# EAGLE design motorCtlv1 (EAGLE 5.11)
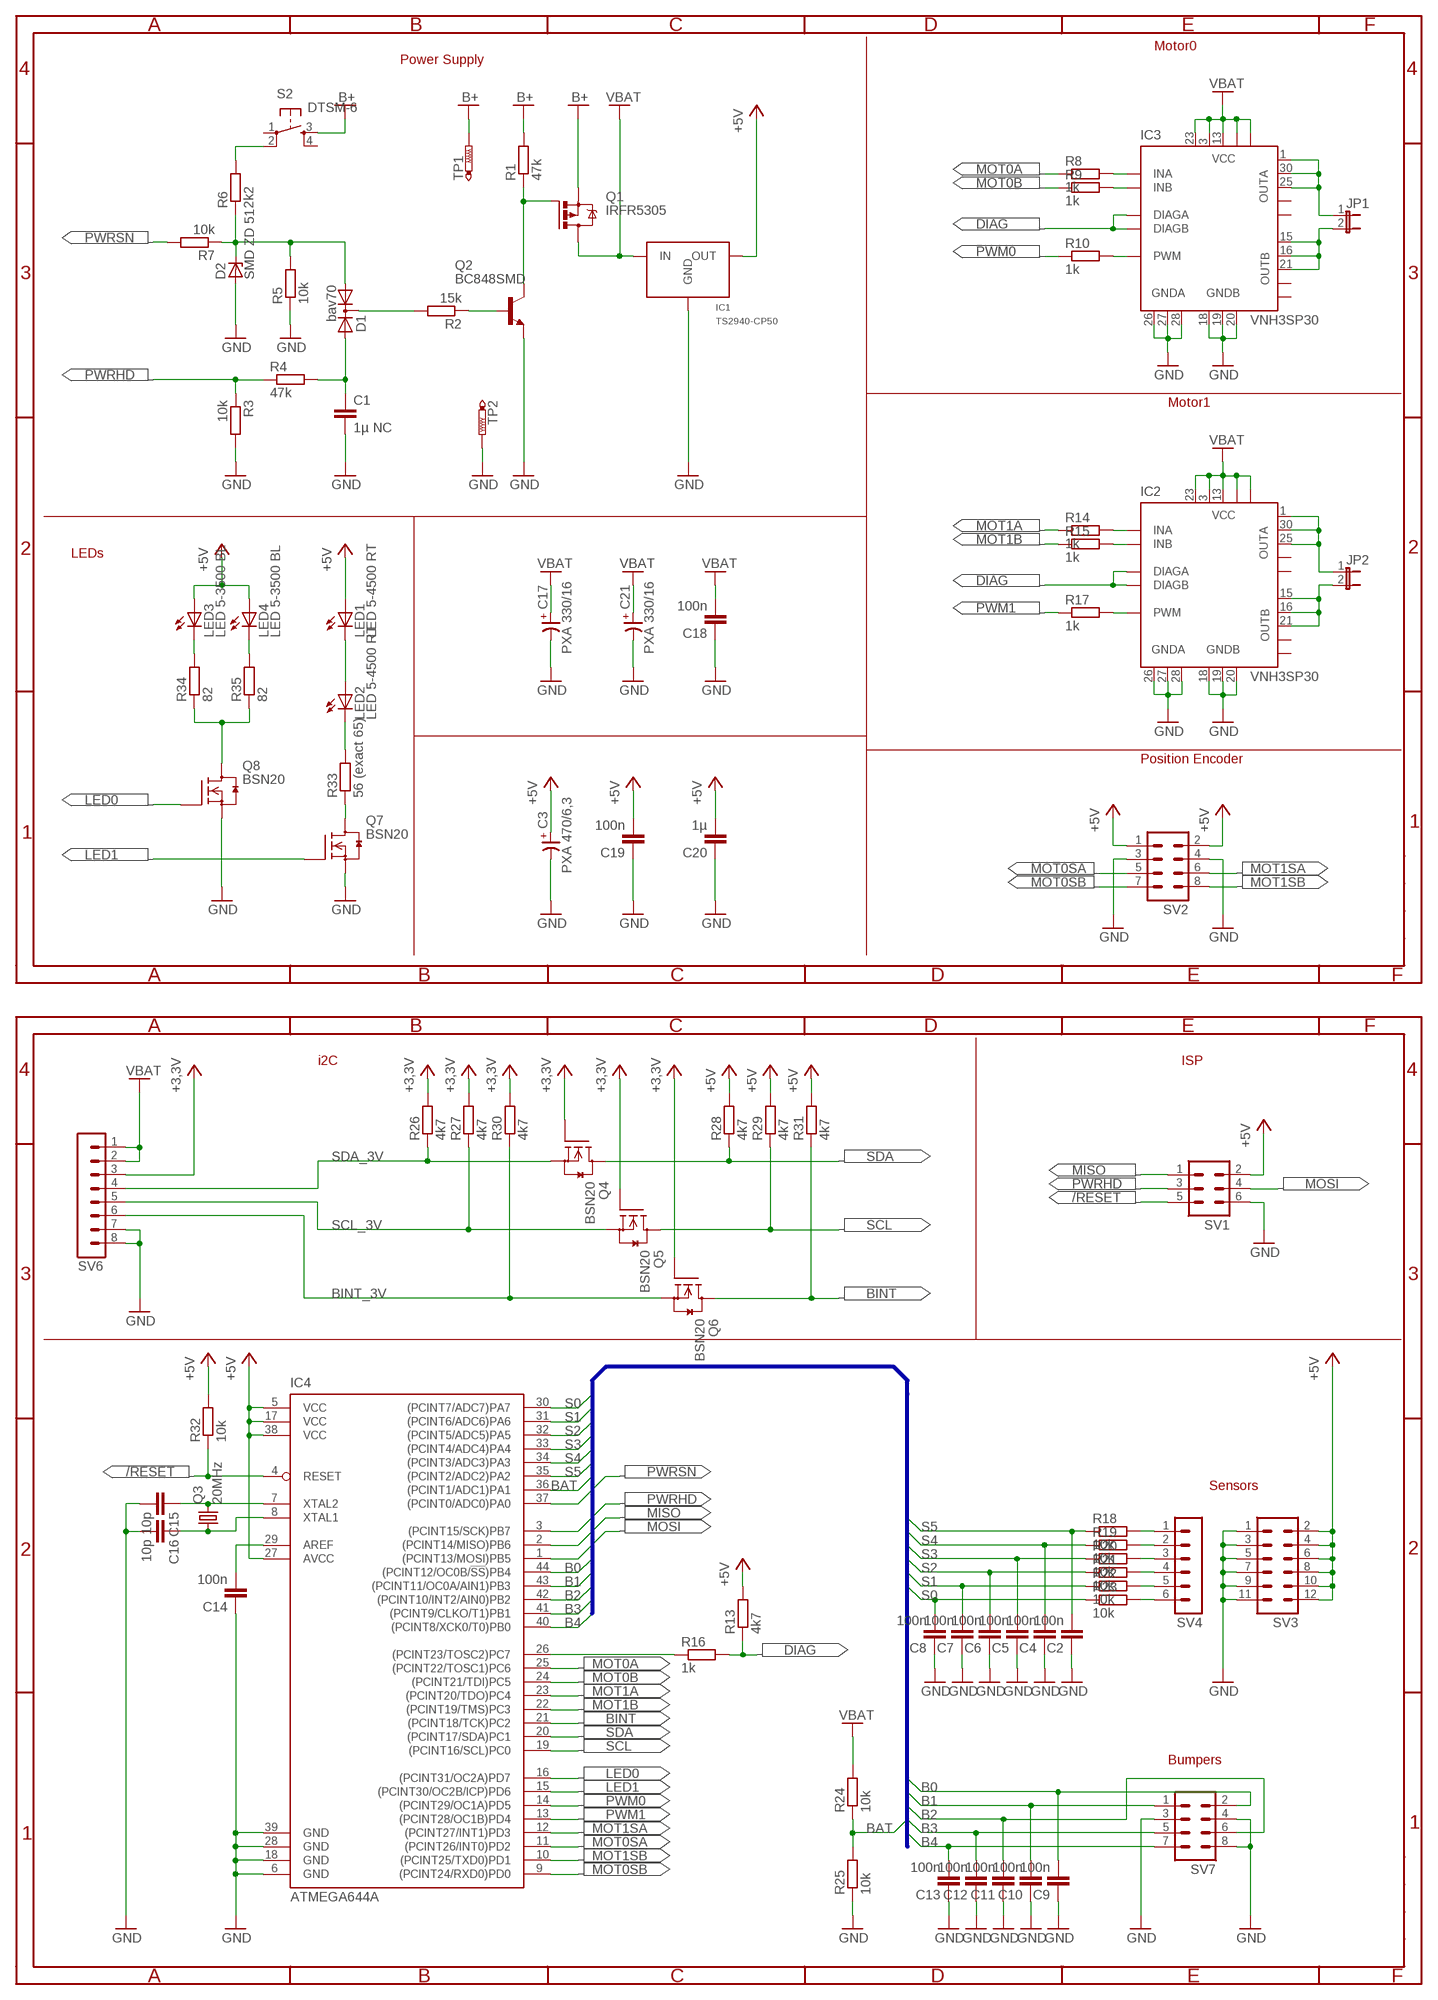
[diagram p0: schematic, sheet 1]

## Parts
C1  1µ NC  C-EUC0603  [C0603]
C2  100n  C-EUC0603  [C0603]
C3  PXA 470/6,3  CP-SV-G  [SV-G]
C4  100n  C-EUC0603  [C0603]
C5  100n  C-EUC0603  [C0603]
C6  100n  C-EUC0603  [C0603]
C7  100n  C-EUC0603  [C0603]
C8  100n  C-EUC0603  [C0603]
C9  100n  C-EUC0603  [C0603]
C10  100n  C-EUC0603  [C0603]
C11  100n  C-EUC0603  [C0603]
C12  100n  C-EUC0603  [C0603]
C13  100n  C-EUC0603  [C0603]
C14  100n  C-EUC0603  [C0603]
C15  10p  C-EUC0603  [C0603]
C16  10p  C-EUC0603  [C0603]
C17  PXA 330/16  CP-SV-G  [SV-G]
C18  100n  C-EUC0603  [C0603]
C19  100n  C-EUC0603  [C0603]
C20  1µ  C-EUC0603  [C0603]
C21  PXA 330/16  CP-SV-G  [SV-G]
D1  bav70  DIODE-2AC|CASOT23  [SOT23]
D2  SMD ZD 51  ZENER-DIODESOT23  [SOT23]
IC1  TS2940-CP50  TS2940  [TO252]
IC2  VNH3SP30  [MULTIPOWERSO-30]
IC3  VNH3SP30  [MULTIPOWERSO-30]
IC4  ATMEGA644A  [TQFP44]
JP1  JP1E  [JP1]
JP2  JP1E  [JP1]
LED1  LED 5-4500 RT  LED5MM  [LED5MM]
LED2  LED 5-4500 RT  LED5MM  [LED5MM]
LED3  LED 5-3500 BL  LED5MM  [LED5MM]
LED4  LED 5-3500 BL  LED5MM  [LED5MM]
Q1  IRFR5305  [D-PAK_TO252AA]
Q2  BC848SMD  [SOT23]
Q3  20MHz  CRYSTALHC49UP  [HC49UP]
Q4  BSN20  BSS138  [SOT23]
Q5  BSN20  BSS138  [SOT23]
Q6  BSN20  BSS138  [SOT23]
Q7  BSN20  BSS138  [SOT23]
Q8  BSN20  BSS138  [SOT23]
R1  47k  R-EU_R0603  [R0603]
R2  15k  R-EU_R0603  [R0603]
R3  10k  R-EU_R0603  [R0603]
R4  47k  R-EU_R0603  [R0603]
R5  10k  R-EU_R0603  [R0603]
R6  2k2  R-EU_R0603  [R0603]
R7  10k  R-EU_R0603  [R0603]
R8  1k  R-EU_R0603  [R0603]
R9  1k  R-EU_R0603  [R0603]
R10  1k  R-EU_R0603  [R0603]
R13  4k7  R-EU_R0603  [R0603]
R14  1k  R-EU_R0603  [R0603]
R15  1k  R-EU_R0603  [R0603]
R16  1k  R-EU_R0603  [R0603]
R17  1k  R-EU_R0603  [R0603]
R18  10k  R-EU_R0603  [R0603]
R19  10k  R-EU_R0603  [R0603]
R20  10k  R-EU_R0603  [R0603]
R21  10k  R-EU_R0603  [R0603]
R22  10k  R-EU_R0603  [R0603]
R23  10k  R-EU_R0603  [R0603]
R24  10k  R-EU_R0603  [R0603]
R25  10k  R-EU_R0603  [R0603]
R26  4k7  R-EU_R0603  [R0603]
R27  4k7  R-EU_R0603  [R0603]
R28  4k7  R-EU_R0603  [R0603]
R29  4k7  R-EU_R0603  [R0603]
R30  4k7  R-EU_R0603  [R0603]
R31  4k7  R-EU_R0603  [R0603]
R32  10k  R-EU_R0603  [R0603]
R33  56 (exact 65)  R-EU_R0603  [R0603]
R34  82  R-EU_R0603  [R0603]
R35  82  R-EU_R0603  [R0603]
S2  DTSM-6  [DTSM-6]
SV1  ML6  [ML6]
SV2  MA04-2  [MA04-2]
SV3  MA06-2  [MA06-2]
SV4  MA06-1  [MA06-1]
SV6  MA08-1  [MA08-1]
SV7  MA04-2  [MA04-2]
TP1  PTR1PAD1-13Y  [P1-13Y]
TP2  PTR1PAD1-13Y  [P1-13Y]

## Nets
0A: IC3.1(OUTA) IC3.25(OUTA) IC3.30(OUTA) JP1.1
0B: IC3.15(OUTB) IC3.16(OUTB) IC3.21(OUTB) JP1.2
1A: IC2.1(OUTA) IC2.25(OUTA) IC2.30(OUTA) JP2.1
1B: IC2.15(OUTB) IC2.16(OUTB) IC2.21(OUTB) JP2.2
$N35: C1.1 D1.2(A2) R4.2
+3,3V: Q4.1(G) Q5.1(G) Q6.1(G) R26.2 R27.2 R30.2 SV6.3
+5V: C3.+ C19.2 C20.2 IC1.R(OUT) IC4.5(VCC) IC4.17(VCC) IC4.27(AVCC) IC4.38(VCC) LED1.A LED3.A LED4.A R13.2 R28.2 R29.2 R31.2 R32.2 SV1.2 SV2.1 SV2.2 SV3.2 SV3.4 SV3.6 SV3.8 SV3.10 SV3.12
/RESET: IC4.4(RESET) R32.1 SV1.5
B0: C9.2 IC4.44((PCINT12/OC0B/!SS!)PB4) SV7.2
B1: C10.2 IC4.43((PCINT11/OC0A/AIN1)PB3) SV7.1
B2: C11.2 IC4.42((PCINT10/INT2/AIN0)PB2) SV7.6
B3: C12.2 IC4.41((PCINT9/CLKO/T1)PB1) SV7.5
B4: C13.2 IC4.40((PCINT8/XCK0/T0)PB0) SV7.7
B+: Q1.3(S) R1.2 S2.3 TP1.TP
BAT: IC4.36((PCINT1/ADC1)PA1) R24.1 R25.2
BINT: IC4.21((PCINT18/TCK)PC2) Q6.3(D) R31.1
BINT_3V: Q6.2(S) R30.1 SV6.6
DIAG: IC2.6(DIAGA) IC2.10(DIAGB) IC3.6(DIAGA) IC3.10(DIAGB) R13.1 R16.2
GND: C1.2 C2.1 C3.- C4.1 C5.1 C6.1 C7.1 C8.1 C9.1 C10.1 C11.1 C12.1 C13.1 C14.1 C15.2 C16.2 C17.- C18.1 C19.1 C20.1 C21.- D2.1(A) IC1.H(GND) IC2.18(GNDB) IC2.19(GNDB) IC2.20(GNDB) IC2.26(GNDA) IC2.27(GNDA) IC2.28(GNDA) IC3.18(GNDB) IC3.19(GNDB) IC3.20(GNDB) IC3.26(GNDA) IC3.27(GNDA) IC3.28(GNDA) IC4.6(GND) IC4.18(GND) IC4.28(GND) IC4.39(GND) Q2.2(E) Q7.2(S) Q8.2(S) R3.2 R5.1 R25.1 SV1.6 SV2.3 SV2.4 SV3.1 SV3.3 SV3.5 SV3.7 SV3.9 SV3.11 SV6.7 SV6.8 SV7.3 SV7.4 SV7.8 TP2.TP
LED0: IC4.16((PCINT31/OC2A)PD7) Q8.1(G)
LED1: IC4.15((PCINT30/OC2B/ICP)PD6) Q7.1(G)
MISO: IC4.2((PCINT14/MISO)PB6) SV1.1
MOSI: IC4.1((PCINT13/MOSI)PB5) SV1.4
MOT0A: IC4.25((PCINT22/TOSC1)PC6) R8.1
MOT0B: IC4.24((PCINT21/TDI)PC5) R9.1
MOT0SA: IC4.11((PCINT26/INT0)PD2) SV2.5
MOT0SB: IC4.9((PCINT24/RXD0)PD0) SV2.7
MOT1A: IC4.23((PCINT20/TDO)PC4) R14.1
MOT1B: IC4.22((PCINT19/TMS)PC3) R15.1
MOT1SA: IC4.12((PCINT27/INT1)PD3) SV2.6
MOT1SB: IC4.10((PCINT25/TXD0)PD1) SV2.8
N$1: LED3.K(C) R34.2
N$2: IC2.8(PWM) R17.2
N$3: IC4.26((PCINT23/TOSC2)PC7) R16.1
N$4: LED4.K(C) R35.2
N$5: IC3.5(INA) R8.2
N$6: IC3.11(INB) R9.2
N$7: LED2.K(C) R33.2
N$8: IC3.8(PWM) R10.2
N$9: Q7.3(D) R33.1
N$10: D1.1(A1) D2.3(C) R5.2 R6.1 R7.1
N$11: LED1.K(C) LED2.A
N$12: R18.2 SV4.1
N$13: IC2.5(INA) R14.2
N$14: IC2.11(INB) R15.2
N$15: R19.2 SV4.2
N$16: R20.2 SV4.3
N$17: R21.2 SV4.4
N$18: R22.2 SV4.5
N$19: R23.2 SV4.6
N$20: C15.1 IC4.7(XTAL2) Q3.2
N$21: C16.1 IC4.8(XTAL1) Q3.1
N$23: C14.2 IC4.29(AREF)
N$26: Q8.3(D) R34.1 R35.1
N$32: Q2.1(B) R2.1
N$33: D1.3(C) R2.2
N$34: Q1.1(G) Q2.3(C) R1.1
N$35: R6.2 S2.2
PWM0: IC4.14((PCINT29/OC1A)PD5) R10.1
PWM1: IC4.13((PCINT28/OC1B)PD4) R17.1
PWRHD: IC4.3((PCINT15/SCK)PB7) R3.1 R4.1 SV1.3
PWRSN: IC4.37((PCINT0/ADC0)PA0) R7.2
S0: C8.2 IC4.30((PCINT7/ADC7)PA7) R23.1
S1: C7.2 IC4.31((PCINT6/ADC6)PA6) R22.1
S2: C6.2 IC4.32((PCINT5/ADC5)PA5) R21.1
S3: C5.2 IC4.33((PCINT4/ADC4)PA4) R20.1
S4: C4.2 IC4.34((PCINT3/ADC3)PA3) R19.1
S5: C2.2 IC4.35((PCINT2/ADC2)PA2) R18.1
SCL: IC4.19((PCINT16/SCL)PC0) Q5.3(D) R29.1
SCL_3V: Q5.2(S) R27.1 SV6.5
SDA: IC4.20((PCINT17/SDA)PC1) Q4.3(D) R28.1
SDA_3V: Q4.2(S) R26.1 SV6.4
VBAT: C17.+ C18.2 C21.+ IC1.L(IN) IC2.3(VCC) IC2.13(VCC) IC2.23(VCC) IC2.VCC IC2.VCC@1(VCC) IC3.3(VCC) IC3.13(VCC) IC3.23(VCC) IC3.VCC IC3.VCC@1(VCC) Q1.4(D) R24.2 SV6.1 SV6.2
Unconnected: IC2.OUTA IC2.OUTA@1(OUTA) IC2.OUTB IC2.OUTB@1(OUTB) IC3.OUTA IC3.OUTA@1(OUTA) IC3.OUTB IC3.OUTB@1(OUTB) S2.1 S2.4

## Buses
S[0..5],B[0..5],BAT

## Notes on the sheet
- Motor0
- Power Supply
- Motor1
- LEDs
- Position Encoder
- i2C | ISP
- Sensors
- Bumpers

## Library data of the parts
C1 C2 C4-C16 C18-C20 = rcl-2:C-EU: CAPACITOR, European symbol
C3 C17 C21 = cap-master:CP-: POLARIZED CAP
D1 = diode:DIODE-2AC|CA: Dual DIODE Anode-Cathode|Cathode-Anode
D2 = diode:ZENER-DIODE: Z-Diode
IC1 = sid:TS2940
IC2 IC3 = st-microelectronics-2:VNH3SP30: FULLY INTEGRATED H-BRIDGE MOTOR DRIVER Source: http://pdf1.alldatasheet.com/datasheet-pdf/view/84563/STMICROELECTRONICS/VNH3SP30.html
IC4 = atmel:ATMEGA644: 8-bit Microcontroller with 64K Bytes In-System Programmable Flash Source: http://www.atmel.com/dyn/resources/prod_documents/doc2593.pdf; MPN: ATMEGA644PV-10AU; OC_FARNELL: 1455123; OC_NEWARK: 58M3748
JP1 JP2 = jumper:JP1E: JUMPER
LED1-LED4 = led:LED: LED OSRAM: - CHIPLED LG R971, LG N971, LY N971, LG Q971, LY Q971, LO R971, LY R971 LH N974, LH R974 LS Q976, LO Q976, LY Q976 LO Q996 - Hyper CHIPLED LW Q18S LB Q993, LB Q99A, LB R99A - SideLED LS A670, LO A670, LY A670, LG A670, LP A670 LB A673, LV A673, LT A673, LW A673 LH A674 LY A675 LS A676, LA A676, LO A676, LY A676, LW A676 LS A679, LY A679, LG A679 - Hyper Micro SIDELED® LS Y876, LA Y876, LO Y876, LY Y876 LT Y87S - SmartLED LW L88C, LW L88S LB L89C, LB L89S, LG L890 LS L89K, LO L89K, LY L89K LS L896, LA L896, LO L896, LY L896 - TOPLED LS T670, LO T670, LY T670, LG T670, LP T670 LSG T670, LSP T670, LSY T670, LOP T670, LYG T670 LG T671, LOG T671, LSG T671 LB T673, LV T673, LT T673, LW T673 LH T674 LS T676, LA T676, LO T676, LY T676, LB T676, LH T676, LSB T676, LW T676 LB T67C, LV T67C, LT T67C, LS T67K, LO T67K, LY T67K, LW E67C LS E67B, LA E67B, LO E67B, LY E67B, LB E67C, LV E67C, LT E67C LW T67C LS T679, LY T679, LG T679 LS T770, LO T770, LY T770, LG T770, LP T770 LB T773, LV T773, LT T773, LW T773 LH T774 LS E675, LA E675, LY E675, LS T675 LS T776, LA T776, LO T776, LY T776, LB T776 LHGB T686 LT T68C, LB T68C - Hyper Mini TOPLED® LB M676 - Mini TOPLED Santana® LG M470 LS M47K, LO M47K, LY M47K Source: http://www.osram.convergy.de LUXEON: - LUMILED® LXK2-PW12-R00, LXK2-PW12-S00, LXK2-PW14-U00, LXK2-PW14-V00 LXK2-PM12-R00, LXK2-PM12-S00, LXK2-PM14-U00 LXK2-PE12-Q00, LXK2-PE12-R00, LXK2-PE12-S00, LXK2-PE14-T00, LXK2-PE14-U00 LXK2-PB12-K00, LXK2-PB12-L00, LXK2-PB12-M00, LXK2-PB14-N00, LXK2-PB14-P00, LXK2-PB14-Q00 LXK2-PR12-L00, LXK2-PR12-M00, LXK2-PR14-Q00, LXK2-PR14-R00 LXK2-PD12-Q00, LXK2-PD12-R00, LXK2-PD12-S00 LXK2-PH12-R00, LXK2-PH12-S00 LXK2-PL12-P00, LXK2-PL12-Q00, LXK2-PL12-R00 Source: www.luxeon.com KINGBRIGHT: KA-3528ASYC Source: www.kingbright.com
Q1 = transistor-power:IRF?5305: HEXFET Power MOSFET Source: http://www.irf.com/product-info/datasheets/data/irfr5305pbf.pdf
Q2 = transistor-npn:BC848*: NPN Transistor
Q3 = crystal:CRYSTAL: CRYSTAL; OC_FARNELL: unknown; OC_NEWARK: unknown
Q4-Q8 = m-pad-2.1:BSS138: Fairchild Semiconductors BSS138 N-Channel Logic Level Enhancement Mode Field Effect Transistor General Description: These N-Channel enhancement mode field effect transistors are produced using Fairchild's proprietary, high cell density, DMOS technology. These products have been designed to minimize on-state resistance while provide rugged, reliable, and fast switching performance.These products are particularly suited for low voltage, low current applications such as small servo motor control, power MOSFET gate drivers, and other switching applications. Features: 0.22 A, 50 V. RDS(ON) = 3.5Ohm @ VGS = 10 V RDS(ON) = 6.0Ohm @ VGS = 4.5 V High density cell design for extremely low RDS(ON) Rugged and Reliable Compact industry standard SOT-23 surface mount package Please send any comments to: messi@users.sourceforge.net
R1-R10 R13-R35 = rcl-2:R-EU_: RESISTOR, European symbol
S2 = switch-tact:DTSM-6
SV1 = con-harting-ml:ML6: HARTING; OC_FARNELL: unknown; OC_NEWARK: unknown
SV2 SV7 = con-lstb:MA04-2: PIN HEADER; OC_FARNELL: unknown; OC_NEWARK: unknown
SV3 = con-lstb:MA06-2: PIN HEADER; OC_FARNELL: unknown; OC_NEWARK: unknown
SV4 = con-lstb:MA06-1: PIN HEADER; OC_FARNELL: unknown; OC_NEWARK: unknown
SV6 = con-lstb:MA08-1: PIN HEADER; OC_FARNELL: unknown; OC_NEWARK: unknown
TP1 TP2 = testpad:PTR1: TEST PIN

## Net classes
0 default: width 0.152 mm, drill 0.305 mm, clearance 0.152 mm
1 pwr: width 0.254 mm, drill 0.305 mm, clearance 0.152 mm

## Board
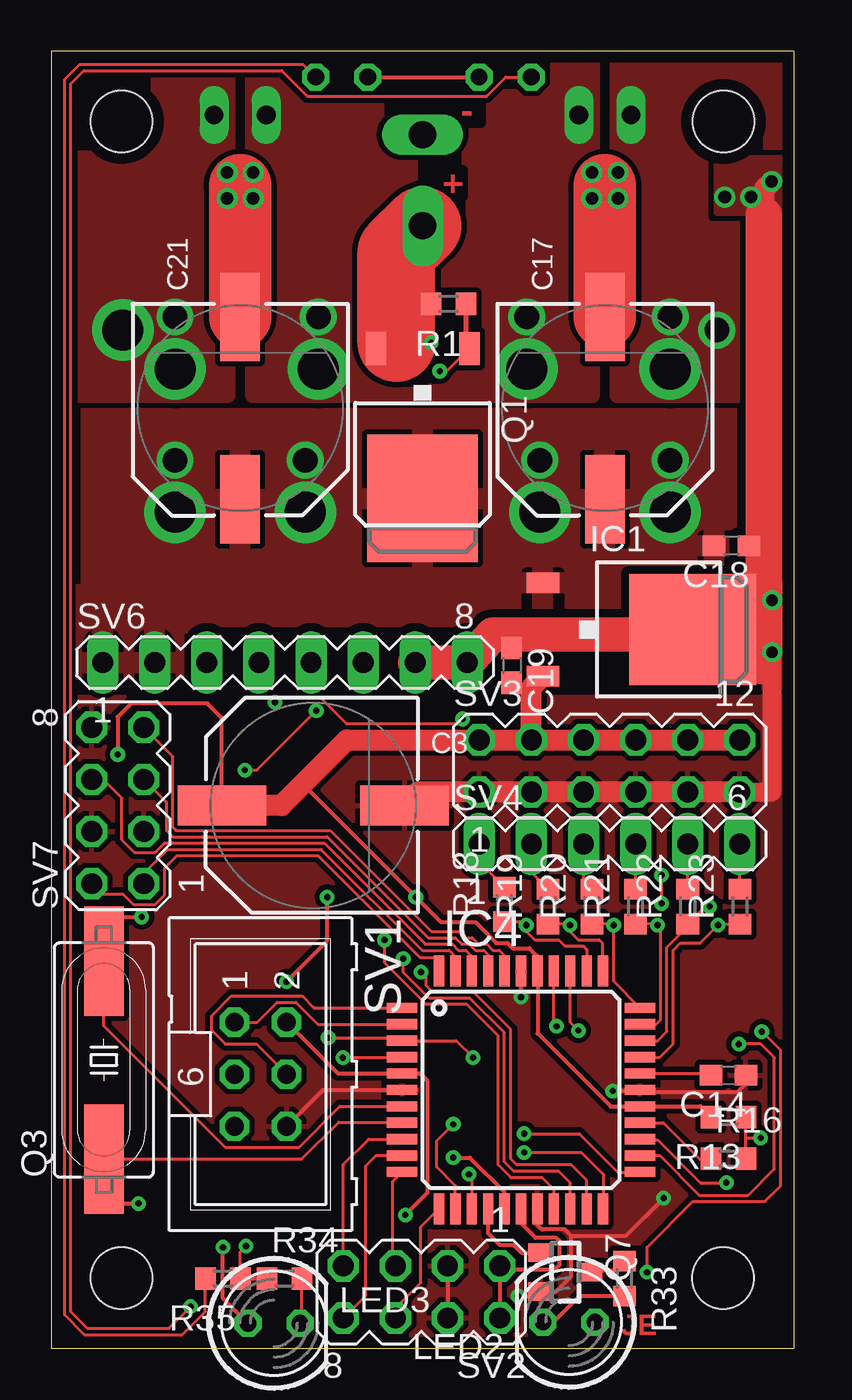
[diagram p1: board, top side]
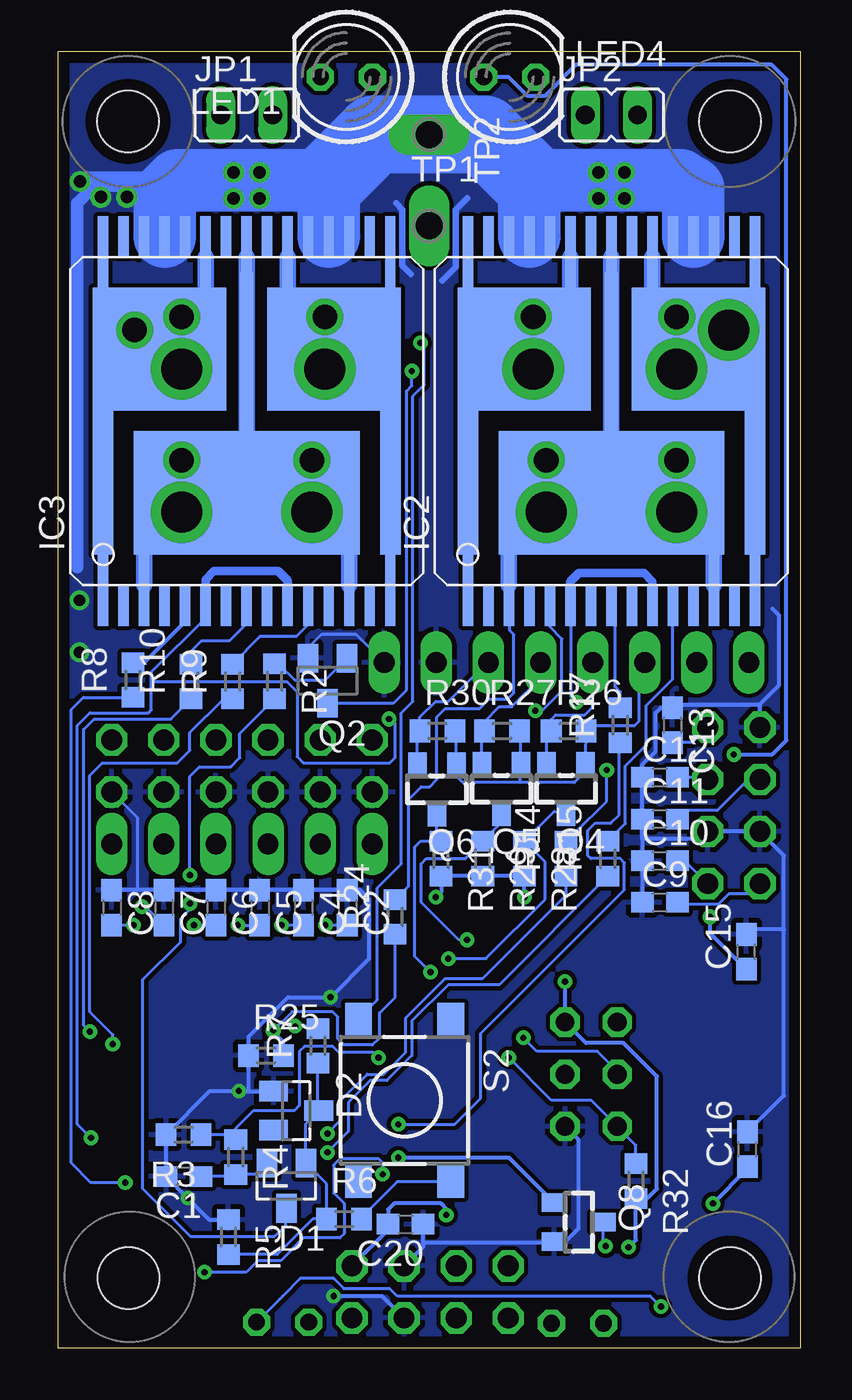
[diagram p2: board, bottom side, seen from below]

Size 36.2 x 63.25 mm. Coordinates in mm from the lower left corner, seen from the top.
Outline: 36.19,63.25 0,63.25 0,0 36.19,0 36.19,63.25
Copper layers (1*16): Top 0.035mm / dielectric 1.5mm / Bottom 0.035mm
Design rules "default *": minimum track width 6mil, minimum drill 12mil, track to track 6mil, track to pad 6mil, pad to pad 6mil, via to via 6mil, smd to smd 6mil, copper to edge 22mil, drill to drill 8mil, minimum pad ring 10mil, minimum via ring 8mil, stop-mask expansion 4mil, vias tented up to drill 24mil, thermal gap 10mil
Holes 3 mm at 32.77,59.82 3.43,59.82 3.43,3.43 32.74,3.43

### Footprints (pad centres in the part's own frame; a part is rotated, then mirrored left to right if it is on the bottom)
C0603 = smd 1.1 x 1: 1 -0.85,0; 2 0.85,0
SV-G = smd 4.318 x 1.93: + -4.445,0; - 4.445,0
SOT23 = smd 1 x 1.4: 1 -0.95,-1.1; 2 0.95,-1.1; 3 0,1.1
TO252 = smd 5.4 x 6.2: H 0,1.23 | smd 1 x 1.6: L -2.28,-6.07; R 2.28,-6.07
MULTIPOWERSO-30 = smd 0.508 x 12: 1 -7,-4; 15 7,-4; 16 7,4; 30 -7,4 | smd 0.508 x 2: 2 -6,-9; 4 -4,-9; 5 -3,-9; 6 -2,-9; 7 -1,-9; 8 0,-9; 9 1,-9; 10 2,-9; 11 3,-9; 12 4,-9; 14 6,-9; 17 6,9; 18 5,9; 19 4,9; 20 3,9; 22 1,9; 24 -1,9; 26 -3,9; 27 -4,9; 28 -5,9; 29 -6,9 | smd 0.508 x 4: 3 -5,-8; 13 5,-8; 21 2,8; 23 0,8; 25 -2,8 | smd 6.5 x 6: OUTA -4.25,3.5; OUTB 4.25,3.5 | smd 1 x 7.5: OUTA@1 -7,-2.755; OUTB@1 7,-2.755 | smd 11 x 6: VCC 0,-3.5 | smd 0.65 x 8.3: VCC@1 0,3.145
TQFP44 = smd 1.5 x 0.5: 1 -5.8,4; 2 -5.8,3.2; 3 -5.8,2.4; 4 -5.8,1.6; 5 -5.8,0.8; 6 -5.8,0; 7 -5.8,-0.8; 8 -5.8,-1.6; 9 -5.8,-2.4; 10 -5.8,-3.2; 11 -5.8,-4; 23 5.8,-4; 24 5.8,-3.2; 25 5.8,-2.4; 26 5.8,-1.6; 27 5.8,-0.8; 28 5.8,0; 29 5.8,0.8; 30 5.8,1.6; 31 5.8,2.4; 32 5.8,3.2; 33 5.8,4 | smd 0.5 x 1.5: 12 -4,-5.8; 13 -3.2,-5.8; 14 -2.4,-5.8; 15 -1.6,-5.8; 16 -0.8,-5.8; 17 0,-5.8; 18 0.8,-5.8; 19 1.6,-5.8; 20 2.4,-5.8; 21 3.2,-5.8; 22 4,-5.8; 34 4,5.8; 35 3.2,5.8; 36 2.4,5.8; 37 1.6,5.8; 38 0.8,5.8; 39 0,5.8; 40 -0.8,5.8; 41 -1.6,5.8; 42 -2.4,5.8; 43 -3.2,5.8; 44 -4,5.8
JP1 = drill 0.914 long: 1 0,-1.27; 2 0,1.27
LED5MM = drill 0.813 octagon: A -1.27,0; K 1.27,0
D-PAK_TO252AA = smd 1 x 1.6: 1 -2.28,-4.8; 3 2.28,-4.8 | smd 5.4 x 6.2: 4 0,2.5
HC49UP = smd 5.334 x 1.93: 1 -4.826,0; 2 4.826,0
SOT23' = smd 0.9 x 1.2: 1 -0.95,-1.2; 2 0.95,-1.2; 3 0,1.2
R0603 = smd 1 x 1.1: 1 -0.85,0; 2 0.85,0
DTSM-6 = smd 1.55 x 1.3: 1 -3.975,2.25; 2 3.975,2.25; 3 -3.975,-2.25; 4 3.975,-2.25
ML6 = drill 0.914 octagon: 1 -2.54,-1.27; 2 -2.54,1.27; 3 0,-1.27; 4 0,1.27; 5 2.54,-1.27; 6 2.54,1.27
MA04-2 = drill 1.016 octagon: 1 -3.81,-1.27; 2 -3.81,1.27; 3 -1.27,-1.27; 4 -1.27,1.27; 5 1.27,-1.27; 6 1.27,1.27; 7 3.81,-1.27; 8 3.81,1.27
MA06-2 = drill 1.016 octagon: 1 -6.35,-1.27; 2 -6.35,1.27; 3 -3.81,-1.27; 4 -3.81,1.27; 5 -1.27,-1.27; 6 -1.27,1.27; 7 1.27,-1.27; 8 1.27,1.27; 9 3.81,-1.27; 10 3.81,1.27; 11 6.35,-1.27; 12 6.35,1.27
MA06-1 = drill 1.016 long: 1 -6.35,0; 2 -3.81,0; 3 -1.27,0; 4 1.27,0; 5 3.81,0; 6 6.35,0
MA08-1 = drill 1.016 long: 1 -8.89,0; 2 -6.35,0; 3 -3.81,0; 4 -1.27,0; 5 1.27,0; 6 3.81,0; 7 6.35,0; 8 8.89,0
P1-13Y = drill 1.321 pad 1.905 long: TP 0,0

### Placement (x,y rotation side)
C1  30.06,8.38 180 bottom
C2  22.09,21.49 270 bottom
C3  12.78,26.47 0 top
C4  24.22,21.49 270 bottom
C5  26.35,21.49 270 bottom
C6  28.49,21.49 270 bottom
C7  31.03,21.49 270 bottom
C8  33.57,21.49 270 bottom
C9  6.85,21.74 0 bottom
C10  6.85,23.77 0 bottom
C11  6.85,25.81 0 bottom
C12  6.85,27.84 0 bottom
C13  6.24,30.38 270 bottom
C14  33.01,13.31 180 top
C15  2.63,19.33 90 bottom
C16  2.58,9.7 90 bottom
C17  26.99,45.85 90 top
C18  33.16,39.14 180 top
C19  22.44,33.3 270 top
C20  19.24,6.05 180 bottom
C21  9.21,45.85 90 top
D1  25.06,7.92 180 bottom
D2  24.57,11.58 270 bottom
IC1  30.04,35.05 270 top
IC2  9.21,45.21 0 bottom
IC3  26.99,45.21 0 bottom
IC4  22.9,12.6 0 top
JP1  26.99,60.13 270 bottom
JP2  9.21,60.13 270 bottom
LED1  22.12,61.99 180 bottom
LED2  25.23,1.27 180 top
LED3  10.86,1.22 0 top
LED4  14.16,61.99 0 bottom
Q1  18.1,43.94 180 top
Q2  23.05,32.55 180 bottom
Q3  2.57,14.06 90 top
Q4  BSN20  [SOT23']  11.42,27.28 180 bottom
Q5  BSN20  [SOT23']  14.57,27.28 180 bottom
Q6  BSN20  [SOT23']  17.72,27.25 180 bottom
Q7  BSN20  [SOT23']  25.06,3.71 270 top
Q8  BSN20  [SOT23']  10.8,6.15 270 bottom
R1  19.37,50.93 180 top
R2  25.63,32.52 270 bottom
R3  30.06,10.41 180 bottom
R4  27.52,9.32 270 bottom
R5  27.88,5.42 270 bottom
R6  22.24,6.3 0 bottom
R7  23.52,14.74 90 bottom
R8  32.54,32.59 90 bottom
R9  27.67,32.51 90 bottom
R10  29.71,32.51 90 bottom
R13  33.01,11.28 180 top
R14  11.42,23.88 90 bottom
R15  9.39,23.88 90 bottom
R16  33.01,9.25 0 top
R17  8.78,30.38 90 bottom
R18  22.09,21.64 90 top
R19  24.22,21.54 90 top
R20  26.35,21.54 90 top
R21  28.49,21.54 90 top
R22  31.03,21.54 90 top
R23  33.57,21.54 90 top
R24  19.75,21.03 90 bottom
R25  26.05,14.27 0 bottom
R26  11.29,30.1 0 bottom
R27  14.54,30.1 0 bottom
R28  13.45,23.88 270 bottom
R29  15.48,23.88 270 bottom
R30  17.69,30.1 0 bottom
R31  17.51,23.88 270 bottom
R32  8.01,8.15 270 bottom
R33  27.94,3.4 270 top
R34  11.37,3.4 0 top
R35  8.37,3.4 180 top
S2  19.29,12.09 270 bottom
SV1  10.2,13.36 270 top
SV2  18.05,2.74 180 top
SV3  27.22,28.4 0 top
SV4  27.22,24.59 0 top
SV6  11.39,33.44 0 top
SV7  3.24,26.47 90 top
TP1  18.1,54.74 0 bottom
TP2  18.1,59.18 270 bottom

### Tracks (layer width: path | path; a pad name or v marks a point on that pad's centre or on a via)
0A  (via drill 1.2, 2)
  Bottom 0.813: IC3.25 28.99,50.29 v30.16,50.29 | v32.45,49.66 33.97,49.66 33.97,49.21 IC3.30 | v30.16,47.75 33.99,47.75 IC3.1
  pour Top (isolate 0.254, rank 3, no thermals): 27.62,62.99 27.62,46.48 36.2,46.48 36.2,62.99
0B  (via drill 1.2, 2)
  Bottom 0.813: IC3.21 24.99,50.29 v23.18,50.29 19.99,50.29 IC3.16 | v23.18,47.75 19.99,47.75 IC3.15
  pour Top (isolate 0.254, rank 3, no thermals): 26.35,62.99 18.73,62.99 18.73,46.48 26.35,46.48
1A  (via drill 1.2, 2)
  Bottom 0.813: IC2.25 11.21,50.29 v13.02,50.29 16.21,50.29 IC2.30 | v13.02,47.75 16.21,47.75 IC2.1
  pour Top (isolate 0.254, rank 3, no thermals): 17.46,62.99 9.84,62.99 9.84,46.48 17.46,46.48
1B  (via drill 1.2, 2)
  Bottom 0.813: IC2.21 7.21,50.29 v6.03,50.29 | v3.49,49.66 2.22,49.66 IC2.16 | v6.03,47.75 2.21,47.75 IC2.15
  pour Top (isolate 0.254, rank 3, no thermals): 8.57,62.99 8.57,46.48 0,46.48 0,62.99
$N35
  Bottom 0.152: D1.2 26.56,8.47 R4.2 27.61,8.38 C1.1
+3,3V
  Bottom 0.152: Q5.1 13.51,28.73 | Q6.1 16.56,28.63 | 13.65,27.58 11.01,27.58 10.47,28.13 Q4.1 10.47,28.83 R26.2 10.31,30.38 8.06,30.38 7.86,30.58 7.86,33.16 SV6.3 | 13.65,27.58 16.45,27.58 16.77,27.9 Q6.1 | Q5.1 13.65,28.49 13.65,27.58 | R27.2 13.62,30.27 Q5.1 | R30.2 16.77,30.17 Q6.1
+5V  (via drill 0.3)
  Top 0.203: LED4.A LED1.A | 12.26,27.51 v17.77,22 18.99,20.78 20.66,20.78 21.68,19.76 22.24,19.76 22.49,19.51 23.3,19.51 23.7,19.11 IC4.38 23.71,18.34 23.71,15.34 27.27,11.79 28.64,11.79 IC4.27 31.64,11.8 R13.2 | v3.24,28.96 3.24,30.78 3.9,31.45 7.61,31.45 8.32,30.73 8.32,26.48 C3.+ | SV1.2 13.97,13.4 IC4.5 17.98,13.4 18.33,13.06 18.33,7.57 v17.26,6.5 | LED3.A 8.37,2.44 v8.37,4.93 | SV2.2 SV2.1 22.01,3.86 24.57,3.86 24.78,4.06 24.78,5.23 24.63,5.38 23.61,5.38 22.9,6.1 IC4.17 | v13.45,22 13.45,19.86 v11.47,17.88
  Top 0.305: C19.2 22.4,32.11 23.41,32.21
  Top 1.016: SV3.4 SV3.2 14.41,29.67 12.26,27.51 11.21,26.47 C3.+ | SV3.4 23.41,32.21 IC1.R | SV3.4 SV3.6 SV3.8 SV3.10 SV3.12
  Bottom 0.203: LED4.A 14.22,61.99 13.3,61.06 12.46,61.06 10.93,62.59 1.38,62.59 0.67,61.87 0.67,29.64 1.36,28.96 v3.24,28.96 | v17.77,22 17.51,22.25 R31.2 R29.2 R28.2 v13.45,22 | v8.37,4.93 8.01,5.28 R32.2 7.47,7.3 7,7.77 7,13.26 8.62,14.88 10.45,14.88 SV1.2 v11.47,17.88 | SV2.1 20.09,5.78 C20.2 20.09,6.77 19.8,7.06 17.51,7.06 17.26,6.81 v17.26,6.5
/RESET  (via drill 0.3)
  Top 0.152: IC4.4 17.07,14.17 v14.21,14.17
  Bottom 0.152: R32.1 8.01,9.91 SV1.5 10.2,12.09 12.13,12.09 v14.21,14.17
B0
  Top 0.152: SV7.2 2.48,22.15 3.49,22.15 4,21.64 5.07,21.64 5.52,22.1 5.52,23.42 6.13,24.03 12.99,24.03 17.97,19.05 18.63,19.05 18.9,18.78 IC4.44
  Bottom 0.152: SV7.2 2.48,22.15 3.49,22.15 4,21.64 5.49,21.64 5.59,21.74 C9.2
B1
  Top 0.152: IC4.43 19.7,19.1 19.39,19.41 18.07,19.41 13.14,24.33 5.68,24.33 4.51,23.16 SV7.1
  Bottom 0.152: C10.2 5.63,23.77 SV7.1
B2
  Top 0.152: IC4.42 20.5,19.11 20.21,19.41 19.85,19.41 19.55,19.71 18.22,19.71 13.3,24.64 5.52,24.64 5.07,24.18 4.05,24.18 3.44,24.79 3.44,26.82 2.53,27.74 SV7.6
  Bottom 0.152: SV7.6 2.53,27.74 4.05,26.21 5.59,26.21 C11.2
B3
  Top 0.152: IC4.41 21.3,19.18 21.07,19.41 20.66,19.41 20.36,19.71 20,19.71 19.7,20.02 18.38,20.02 13.45,24.94 5.93,24.94 5.63,25.25 5.63,26.62 SV7.5
  Bottom 0.152: C12.2 4.61,27.84 SV7.5
B4
  Top 0.152: IC4.40 22.1,19.14 21.83,19.41 21.53,19.41 21.22,19.71 20.82,19.71 20.51,20.02 20.15,20.02 19.85,20.32 18.53,20.32 13.6,25.25 6.08,25.25 5.93,25.4 5.93,28.85 SV7.7
  Bottom 0.152: C13.2 5.26,29.53 SV7.7
B+  (via drill 0.3)
  Top 0.254: R1.2 v18.52,49.02 16.83,49.02
  Top 1.016: 16.83,49.02 16.47,48.74 Q1.3
  Top 3.81: TP1.TP 16.83,53.47 16.83,49.02
  Bottom 0.152: v18.52,49.02 18.33,48.83 18.33,46.99 18.88,46.43 18.88,31.55 19.44,30.99 19.44,23.62 20.61,22.45 20.61,16.99 S2.3
BAT  (via drill 0.3)
  Top 0.152: IC4.36 25.3,15.89 v25.69,15.49
  Bottom 0.152: R24.1 19.75,17.12 20.51,16.36 20.51,15.14 20.87,14.78 22.24,14.78 22.54,15.09 22.54,16.15 22.8,16.41 24.78,16.41 v25.69,15.49 25.2,15 R25.2
BINT  (via drill 0.3)
  Top 0.152: IC4.21 26.1,8.18 25.34,8.94 22.69,8.94 22.39,9.25 22.39,15.54 20.56,17.37 18.58,17.37 18.28,17.68 18.28,18.09 v18.02,18.34
  Bottom 0.152: Q6.3 17.72,24.93 R31.1 18.49,24.73 18.78,24.43 18.78,19.1 v18.02,18.34
BINT_3V
  Bottom 0.152: Q6.2 18.67,29.97 R30.1 18.54,30.77 17.77,31.55 17.16,31.55 15.27,33.44 SV6.6
DIAG  (via drill 0.3)
  Top 0.152: 33.86,10.26 v34.58,10.26 | 33.86,10.26 R13.1 | R16.2 33.86,10.26 | v10.91,31.5 11.09,31.67 13.17,31.67 14.41,30.43 19.8,30.43 v20.05,30.68
  Bottom 0.152: IC3.6 28.99,35.62 31.64,32.97 31.64,32.51 | 31.64,32.51 31.64,31.14 31.79,30.99 34.63,30.99 35.24,30.38 35.24,10.92 v34.58,10.26 | IC2.6 11.16,36.17 11.16,31.75 v10.91,31.5 | v20.05,30.68 19.85,30.48 19.75,30.48 19.75,28.8 20,28.55 24.22,28.55 24.52,28.85 24.52,32 25.03,32.51 31.64,32.51
  Bottom 0.406: IC3.10 24.99,37.45 25.44,37.9 28.59,37.9 28.99,37.49 IC3.6 | IC2.10 7.21,37.39 7.61,37.8 10.81,37.8 11.21,37.39 IC2.6
GND  (via drill 0.3, 0.56, 0.61)
  Top 0.203: v22.9,17.12 IC4.39 | SV1.6 13.25,12.6 IC4.6 | SV2.3 SV2.4 | C14.1 33.86,12.89 33.46,12.5 28.8,12.5 IC4.28 28.65,12.55 v27.37,12.55 | 25.34,5.49 28.02,5.49 v29.85,7.32 | 25.34,5.49 25.34,3.51 24.59,2.76 Q7.2 23.54,2.54 v22.75,2.54 | IC4.18 23.7,6.01 23.91,5.79 25.03,5.79 25.34,5.49
  Top 0.305: C19.1 22.39,33.82 21.73,34.8
  Top 0.914: v35.14,33.93 35.14,27.13 SV3.11
  Top 0.991: IC1.H 34.76,35.05 v35.14,33.93 v35.14,36.47 | v35.14,36.47 34.73,36.98 | 34.58,32.87 34.58,37.24 35.14,37.24 v35.14,36.47 | 34.73,55.24 34.76,56.54 v35.12,56.9
  Top 1.016: v27.62,57.34 26.99,56.71 v26.35,57.34 | v26.35,56.07 26.67,56.64 26.99,56.64 27.3,56.64 v27.62,56.07 | v9.84,56.07 9.84,55.37 9.21,56.71 v9.84,57.34 | IC1.H 29.67,34.8 | SV3.11 SV3.9 SV3.7 SV3.5 SV3.3 SV3.1 17.88,27.13 C3.-
  Top 1.676: 29.67,34.8 21.73,34.8 21.51,34.8 SV6.8 SV6.7 | 34.73,36.98 34.73,36.96
  Top 1.778: 34.73,36.98 34.73,55.24
  Top 3.048: 26.99,56.71 26.99,56.64 C17.- | 9.21,56.71 C21.-
  Bottom 0.152: C8.1 34.04,22.36 | 7.71,24.84 7.7,24.85 | 7.71,23.79 C10.1 | Q2.2 24,34.15 23.36,34.8 21.64,34.8 SV6.8 | SV3.11 32.3,25.86 32.3,22.34
  Bottom 0.203: 1.36,36.07 1.03,35.74 1.03,32.33 1.97,31.39 | C8.1 32.3,22.34 C7.1 C6.1 C5.1 C4.1 C2.1 21.46,22.34 21.02,21.89 21.02,19 v22.9,17.12 24.98,17.12 26.9,15.2 R25.1 26.9,12.55 v27.37,12.55 | 1.97,31.39 SV7.8 | 1.97,31.39 6.07,31.39 C13.1 6.81,31.23 7.05,30.99 7.05,29.11 7.7,28.46 C12.1 C11.1 7.7,24.85 | 7.71,23.79 7.71,24.84 4.86,24.84 SV7.3 SV7.4 0.8,24.03 0.8,20.42 | C10.1 C9.1 | 0.8,20.42 2.63,20.42 C15.2 | C16.2 0.8,12.33 0.8,20.42 | 18.39,5.13 18.39,4.94 SV2.3 | 18.39,5.13 C20.1 | SV1.6 10.81,10.16 10.81,5.84 11.45,5.2 Q8.2 12.06,5.13 18.39,5.13 | 25.69,12.55 D2.1 27.35,12.53 v27.37,12.55 | v27.37,12.55 28.78,12.55 R3.2 C1.2 v29.85,7.32 28.8,6.27 R5.1 | v22.75,2.54 20.38,2.54 SV2.4
  Bottom 0.305: 17.46,52.07 16.8,52.73 16.8,55.52 16.24,56.08 | 18.99,52.37 19.39,52.78 19.39,55.52 19.7,55.83
  Bottom 0.61: 35.24,38.1 35.24,55.83 34.07,57 31.66,57 30.99,56.32
  Bottom 0.991: v35.12,56.9 28.51,56.9
  Bottom 1.016: IC3.26 IC3.27 IC3.28 | IC3.20 IC3.19 IC3.18 | v27.62,56.07 27.3,56.64 27.3,56.96 | IC2.28 IC2.27 IC2.26 | IC2.20 IC2.19 IC2.18 | v8.57,57.34 v8.57,56.07 v9.84,56.07 | v9.84,57.34 9.52,57.59 9.21,56.96
  Bottom 3.048: IC3.19 22.99,56.96 27.3,56.96 30.35,56.96 30.99,56.32 IC3.27 | IC2.19 5.21,56.45 arc-90 5.4,56.64 5.84,56.96 9.21,56.96 13.21,56.96 IC2.27
  Bottom 3.81: 22.99,56.96 20.76,59.18 TP2.TP 15.43,59.18 13.21,56.96
  other vias: 32.83,56.13 34.1,56.13
  pour Bottom (isolate 0.203): 36.2,63.25 0,63.25 0,0 36.2,0
  pour Top: 35.62,58.04 32.45,58.04 32.45,55.37 34.07,55.37 34.07,32.26 35.62,32.26 35.62,55.02 35.62,55.37
  pour Top (isolate 0.254): 0.19,0.25 36,0.25 36,31.75 0.19,31.75
LED0  (via drill 0.3)
  Top 0.203: v19.6,9.3 20.41,9.3 22.09,7.62 22.09,6.81 IC4.16
  Bottom 0.203: Q8.1 14.19,9.3 v19.6,9.3
LED1
  Top 0.203: IC4.15 21.3,5.61 21.88,5.03 22.54,5.03 22.91,4.66 Q7.1
MISO
  Top 0.152: SV1.1 10.05,15.9 11.01,16.87 11.93,16.87 12.99,15.8 IC4.2
MOSI
  Top 0.152: SV1.4 9.99,14.83 8.47,14.83 7.81,15.49 7.81,16.2 8.78,17.17 12.23,17.17 12.8,16.6 IC4.1
MOT0A  (via drill 0.3)
  Top 0.152: v32.91,8.08 31.64,8.08 29.55,10.16 28.74,10.16 IC4.25
  Bottom 0.152: R8.1 34.95,31.74 35.55,31.14 35.55,9.04 34.58,8.08 v32.91,8.08
MOT0B  (via drill 0.3)
  Top 0.152: v33.52,14.83 34.58,14.83 35.24,14.17 35.24,8.74 33.97,7.47 31.58,7.47 29.65,9.4 IC4.24 | IC4.24
  Bottom 0.152: R9.1 28.12,31.66 29.76,30.02 29.76,29.16 30.37,28.55 34.02,28.55 34.63,27.94 34.63,16.41 33.52,15.29 v33.52,14.83
MOT0SA
  Top 0.152: SV2.5 16.65,4.14 16.65,8.15 IC4.11
MOT0SB
  Top 0.152: IC4.9 15.47,10.2 14.24,8.97 SV2.7
MOT1A  (via drill 0.3)
  Top 0.152: v23.05,10.47 25.74,10.47 27.62,8.58 28.68,8.58 IC4.23
  Bottom 0.152: v23.05,10.47 22.39,11.13 22.39,12.09 21.12,13.36 20.31,13.36 19.24,14.43 19.24,16.1 17.31,18.03 15.48,18.03 11.42,22.1 R14.1
MOT1B  (via drill 0.3)
  Top 0.152: v23.05,9.55 25.84,9.55 26.91,8.48 IC4.22
  Bottom 0.152: v23.05,9.55 22.03,10.57 22.03,11.99 20.97,13.06 20.15,13.06 18.94,14.28 18.94,15.95 17.16,17.73 14.68,17.73 R15.1
MOT1SA
  Top 0.152: IC4.12 18.02,5.92 18.02,3.2 16.78,1.96 SV2.6
MOT1SB
  Top 0.152: IC4.10 15.84,9.4 15.33,8.89 15.33,2.56 SV2.8
N$1
  Top 0.152: R34.2 12.22,1.31 LED3.K
N$2
  Bottom 0.152: IC2.8 9.03,36.03 9.03,32.26 8.78,32 R17.2
N$3
  Top 0.152: IC4.26 29.83,11 31.58,9.25 R16.1
N$4
  Top 0.152: LED4.K 12.27,62.61 1.38,62.61 0.65,61.87 0.65,1.63 1.61,0.66 6.39,0.66 7.51,1.78 7.51,3.39 R35.2
N$5
  Bottom 0.203: IC3.5 29.99,35.43 31.98,33.44 R8.2
N$6
  Bottom 0.152: IC3.11 23.99,35.28 24.57,34.7 26.34,34.7 R9.2
N$7
  Top 0.203: R33.2 25.76,2.55 24.47,1.27 LED2.K
N$8
  Bottom 0.152: IC3.8 26.99,35.33 27.83,34.49 29.2,34.49 29.71,33.98 R10.2
N$9
  Top 0.152: Q7.3 26.66,3.8
  Top 0.203: 26.66,3.8 27.48,3.8 R33.1
N$10
  Bottom 0.152: R7.1 23.52,11.63 D2.3 24.11,10.95 D1.1 23.09,8.01 R6.1 23.76,6.3 25.49,4.57 R5.2
N$11  (via drill 0.3)
  Top 0.152: LED1.K 22.15,61.99 21.22,61.06 12.48,61.06 11.24,62.31 1.59,62.31 0.95,61.67 0.95,1.78 1.77,0.96 5.73,0.96 v6.79,2.03
  Bottom 0.152: v6.79,2.03 7.3,2.54 19.65,2.54 20,2.9 22.24,2.9 22.75,3.4 24.37,3.4 25.23,2.54 25.39,2.39 LED2.A
N$12
  Top 0.152: R18.2 20.92,23.66 20.92,24.49 SV4.1
N$13  (via drill 0.3)
  Top 0.152: v9.44,28.19 10.02,28.19 v12.92,31.09
  Bottom 0.152: 11.42,24.78 R14.2 10.97,24.73 10.96,24.74 10.96,25.15 9.44,26.67 v9.44,28.19 | IC2.5 12.21,35.18 11.62,34.59 11.62,32.05 12.59,31.09 v12.92,31.09
N$14
  Bottom 0.152: IC2.11 6.21,32.64 7.51,31.34 7.51,29.41 8.52,28.4 8.52,25.59 R15.2
N$15
  Top 0.152: R19.2 23.91,22.69 23.41,23.22 SV4.2
N$16
  Top 0.152: R20.2 25.95,22.8 SV4.3
N$17
  Top 0.152: R21.2 SV4.4
N$18
  Top 0.152: R22.2 SV4.5
N$19
  Top 0.152: R23.2 SV4.6
N$20  (via drill 0.3)
  Top 0.152: Q3.2 2.57,15.71 8.47,9.8 12.08,9.8 14.07,11.8 IC4.7
  Top 0.203: v4.41,21.03 2.57,21.03 Q3.2
  Bottom 0.203: C15.1 4.41,20.26 v4.41,21.03
N$21  (via drill 0.3)
  Top 0.152: Q3.1 12.22,9.23 14.01,11.02 17.07,11.02 IC4.8
  Top 0.203: v4.25,7.06 2.57,7.06 Q3.1
  Bottom 0.203: C16.1 2.58,8.74 v4.25,7.06
N$23
  Top 0.152: IC4.29 32.07,13.4 C14.2
N$26  (via drill 0.3)
  Top 0.152: R35.1 9.22,4.71 v9.49,4.98
  Top 0.203: R35.1 R34.1
  Bottom 0.152: v9.49,4.98 9.59,5.09 Q8.3
N$32
  Bottom 0.152: Q2.1 23.19,32.56 24.63,32.56 25.44,33.38 R2.1
N$33  (via drill 0.3)
  Top 0.152: v29.76,21.69 v29.76,23.06
  Bottom 0.152: v29.76,21.69 29.76,21.39 30.21,20.93 30.21,19.81 32.04,17.98 32.04,7.77 29.71,5.44 25.64,5.44 25.08,5.99 25.08,6.8 D1.3 | v29.76,23.06 29.76,27.89 29.3,28.35 27.77,28.35 27.32,28.8 27.32,29.99 R2.2
N$34  (via drill 0.3)
  Top 0.152: Q1.1 19.29,47.65 v18.94,47.65
  Top 0.254: R1.1 20.22,48.74 Q1.1
  Bottom 0.152: v18.94,47.65 18.94,46.94 19.19,46.68 19.19,32.11 19.85,31.45 Q2.3
N$35
  Bottom 0.152: S2.2 19.66,8.12 21.39,6.39 R6.2
PWM0  (via drill 0.3)
  Top 0.152: v34.63,15.44 35.55,14.53 35.55,7.92 34.79,7.16 31.28,7.16 29.04,4.93 v29.04,3.71 | v20.36,8.48 20.51,8.33 IC4.14
  Bottom 0.152: R10.1 30.68,30.68 34.43,30.68 34.94,30.17 34.94,15.75 v34.63,15.44 | v29.04,3.71 27.01,3.71 26.45,4.27 25.34,4.27 24.22,5.38 22.44,5.38 22.24,5.59 22.24,7.06 22.75,7.57 22.75,8.94 22.44,9.25 20.56,9.25 20.36,9.04 v20.36,8.48
PWM1  (via drill 0.3)
  Top 0.152: v19.6,10.92 18.78,10.11 18.78,8.84 19.7,7.92 IC4.13
  Bottom 0.152: R17.1 8.83,29.48 8.83,26.01 9.23,25.6 9.99,25.6 10.35,25.25 10.35,24.03 10.2,23.88 8.78,23.88 8.57,23.67 8.57,22.35 15.58,15.34 15.58,12.19 16.85,10.92 v19.6,10.92
PWRHD  (via drill 0.3)
  Top 0.152: v13.5,15.14 16.96,15.14 IC4.3 19.74,15 v20.56,14.17
  Bottom 0.152: v13.5,15.14 12.84,14.48 9.89,14.48 8.93,13.51 SV1.3 | R3.1 27.76,10.41 R4.1 27.52,10.72 26.66,11.58 24.68,11.58 24.42,11.84 24.42,14.48 24.17,14.73 22.8,14.73 22.49,14.43 20.82,14.43 v20.56,14.17
PWRSN  (via drill 0.3)
  Top 0.152: IC4.37 24.5,15.82 v24.63,15.7
  Bottom 0.152: v24.63,15.7 23.62,15.7 R7.2
S0  (via drill 0.3)
  Top 0.152: R23.1 32.56,20.69 v32.5,20.62 31.64,19.76 30.67,19.76 30.31,19.41 30.31,14.83 29.65,14.17 28.74,14.17 IC4.30
  Bottom 0.152: C8.2 33.55,20.62 v32.5,20.62
S1  (via drill 0.3)
  Top 0.152: IC4.31 29.57,15 30.01,15.44 30.01,19.56 30.98,20.52 30.98,20.68 R22.1 31.88,21.54 v32.09,21.54
  Bottom 0.152: C7.2 31.93,21.54 v32.09,21.54
S2  (via drill 0.3)
  Top 0.152: R21.1 29.49,20.69 v29.55,20.62 29.71,20.47 29.71,16 29.5,15.8 IC4.32
  Bottom 0.152: v29.55,20.62 29.54,20.64 C6.2
S3  (via drill 0.3)
  Top 0.152: R20.1 27.35,20.69 v27.42,20.62 27.42,17.88 IC4.33
  Bottom 0.152: C5.2 26.37,20.62 v27.42,20.62
S4  (via drill 0.3)
  Top 0.152: R19.1 25.22,20.69 v25.29,20.62 25.29,20.32 25.69,19.91 26.71,19.91 26.86,19.76 26.86,18.44 IC4.34
  Bottom 0.152: C4.2 24.23,20.62 v25.29,20.62
S5  (via drill 0.3)
  Top 0.152: R18.1 22.99,20.79 v23.15,20.62 23.15,20.32 23.56,19.91 24.73,19.91 25.03,19.61 25.95,19.61 26.1,19.46 IC4.35
  Bottom 0.152: C2.2 22.1,20.62 v23.15,20.62
SCL  (via drill 0.3)
  Top 0.152: IC4.19 24.5,7.75 23.91,8.33 22.39,8.33 21.78,8.94 21.78,15.24 20.26,16.76 18.28,16.76 16.24,18.8 v16.24,19.91
  Bottom 0.152: Q5.3 14.57,25.64 R29.1 16.33,23.88 18.22,23.88 18.48,23.62 18.48,21.74 16.65,19.91 v16.24,19.91
SCL_3V
  Bottom 0.152: 15.21,28.73 Q5.2 15.52,30.07 R27.1 15.39,30.57 14.67,31.29 14.06,31.29 12.66,32.69 SV6.5
SDA  (via drill 0.3)
  Top 0.152: IC4.20 25.3,8.06 24.73,8.64 22.54,8.64 22.09,9.09 22.09,15.39 20.41,17.07 18.43,17.07 17.16,18.34 v17.16,19
  Bottom 0.152: Q4.3 11.99,26.18 R28.1 12.43,23.71 12.43,21.89 15.33,19 v17.16,19
SDA_3V
  Bottom 0.152: 12.17,28.63 Q4.2 12.37,30.02 R26.1 | R26.1 12.17,30.29 | SV6.4 10.12,31.27 10.5,30.89 11.93,30.89 12.17,30.65 R26.1
VBAT  (via drill 1.2, 2)
  Bottom 0.152: IC3.3 31.99,41.66 31.38,42.27 27.39,42.27 26.99,42.67 | 9.21,42.67 IC2.VCC C21.+ 11.75,41.4 v12.38,40.77 | IC3.VCC 28.57,41.71 v30.16,43.31 | R24.2 19.09,22.54 19.09,26.77 18.48,27.38 18.07,27.38 17.72,27.74 17.72,30.78 17.31,31.19 15.63,31.19 15.18,31.65 14.26,31.65 13.96,31.95 13.96,34.8 14.16,35 14.16,37.16 IC2.3
  Bottom 0.813: IC3.3 31.99,40.77 v30.16,40.77 | IC3.13 21.99,40.77 v23.81,40.77 | 26.99,42.67 IC3.VCC@1 IC3.23 | v12.38,40.77 14.21,40.77 IC2.3 | v6.03,40.77 4.21,40.77 IC2.13 | 9.21,42.67 IC2.VCC@1 IC2.23
  other vias: 23.81,43.31 12.38,43.31 6.03,43.31
  pour Top (isolate 0.406, rank 2): 36.2,45.34 0,45.34 0,33.07 6.79,33.07 6.79,35.69 36.2,35.69
  pour Top: 0.65,37.08 6.34,37.08 6.34,32.77 0.65,32.77

### Text on the board
Top: - | + | JE